# EAGLE schematic 508_outin_imp (EAGLE 8.1.1)
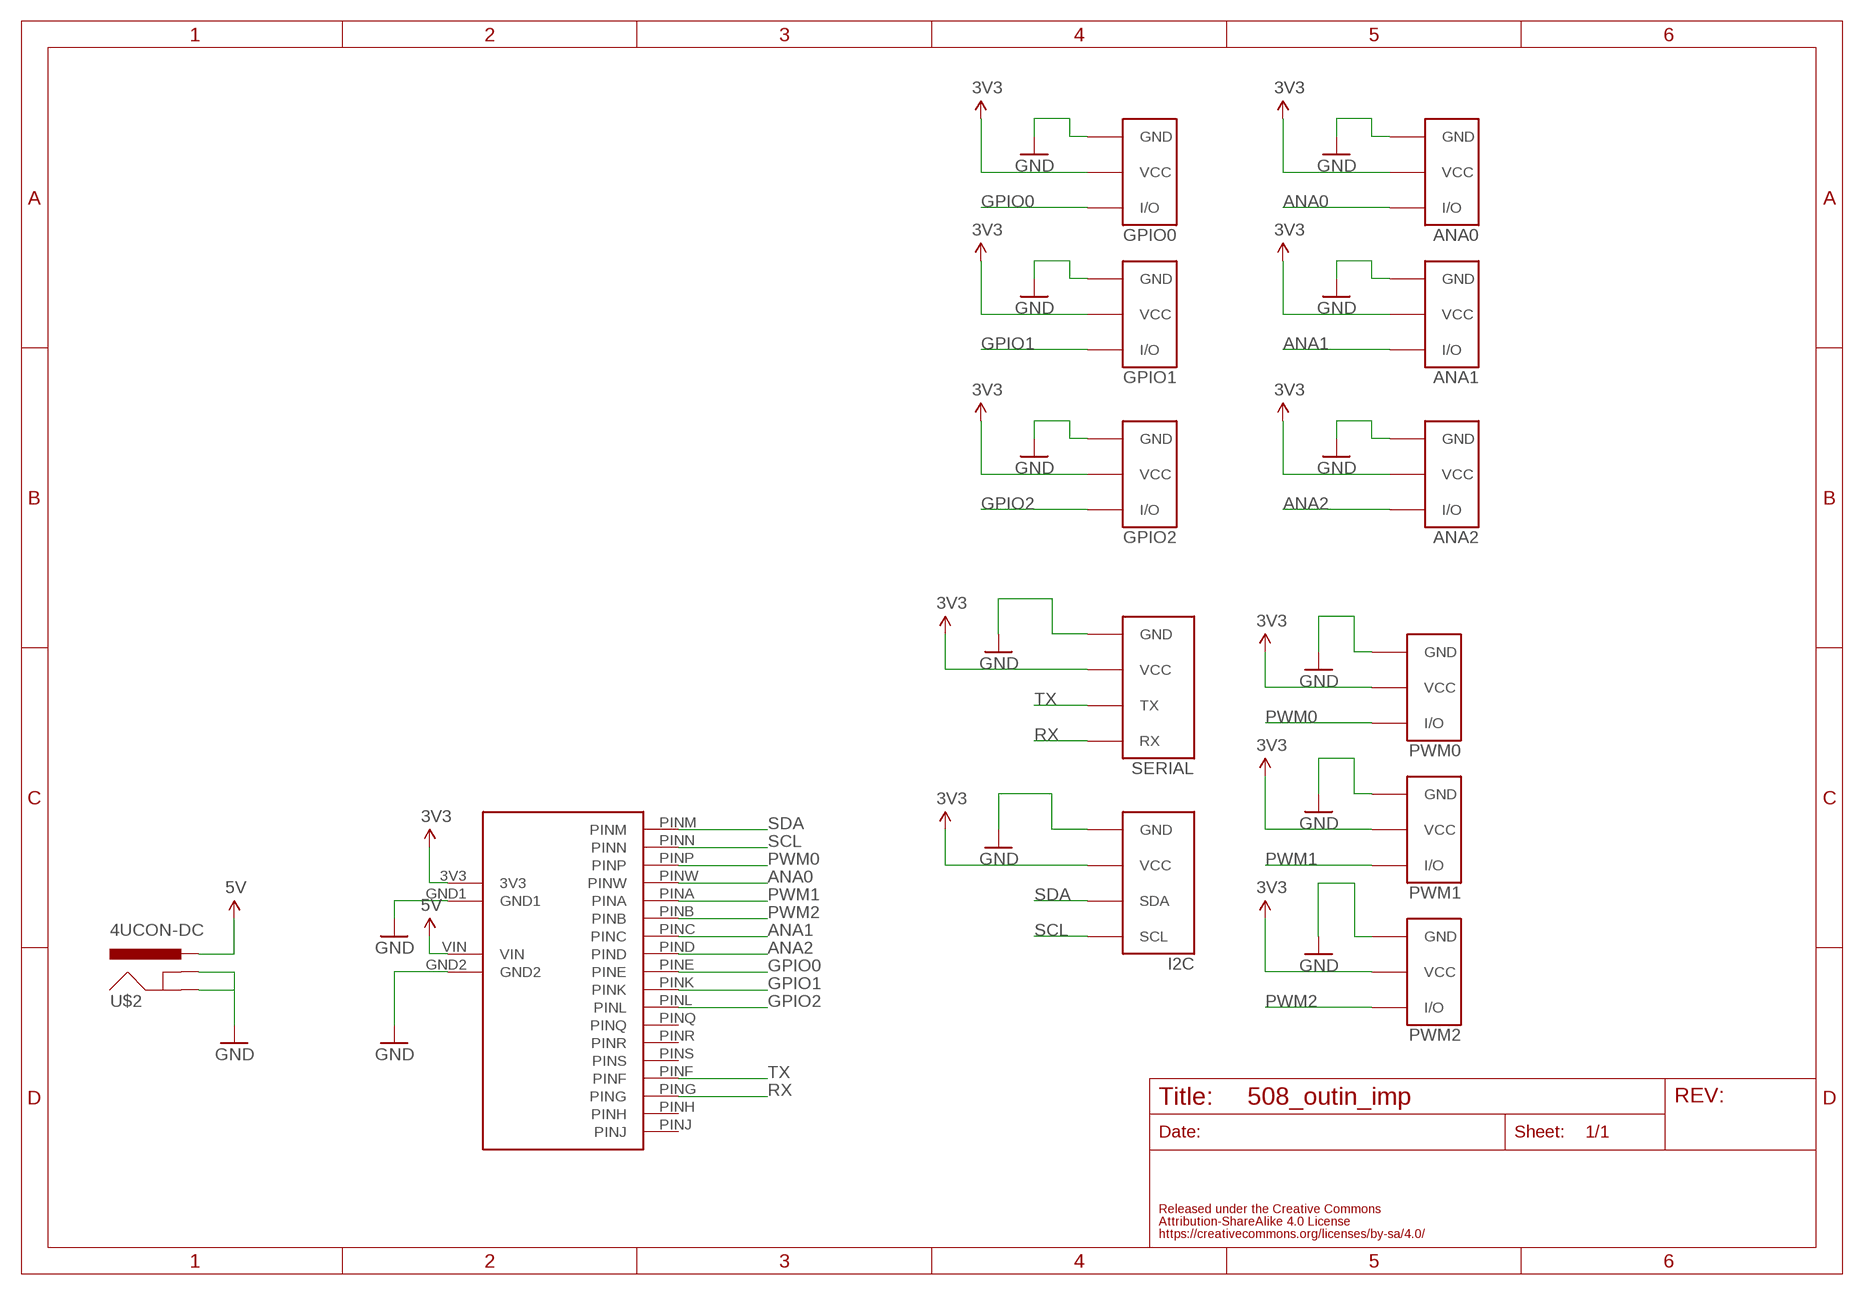
[diagram p0: schematic, sheet 1]

## Parts
ANA0  FABO_BRICK_3PIN-B03B-PASK-1_SILK  [FABO_BRICK_3PIN_B03B-PASK-1_SILK]
ANA1  FABO_BRICK_3PIN-B03B-PASK-1_SILK  [FABO_BRICK_3PIN_B03B-PASK-1_SILK]
ANA2  FABO_BRICK_3PIN-B03B-PASK-1_SILK  [FABO_BRICK_3PIN_B03B-PASK-1_SILK]
GPIO0  FABO_BRICK_3PIN-B03B-PASK-1_SILK  [FABO_BRICK_3PIN_B03B-PASK-1_SILK]
GPIO1  FABO_BRICK_3PIN-B03B-PASK-1_SILK  [FABO_BRICK_3PIN_B03B-PASK-1_SILK]
GPIO2  FABO_BRICK_3PIN-B03B-PASK-1_SILK  [FABO_BRICK_3PIN_B03B-PASK-1_SILK]
I2C  FABO_BRICK_I2C-S04B-PASK-2_LONG  [FABO_BRICK_I2C_S04B-PASK-2_LONG]
PWM0  FABO_BRICK_3PIN-HEADER  [FABO_BRICK_3PIN_HEADER]
PWM1  FABO_BRICK_3PIN-HEADER  [FABO_BRICK_3PIN_HEADER]
PWM2  FABO_BRICK_3PIN-HEADER  [FABO_BRICK_3PIN_HEADER]
SERIAL  FABO_BRICK_SERIAL-S04B-PASK-2_LONG  [FABO_BRICK_SERIAL_S04B-PASK-2_LONG]
U$1  FABO-IMP  [FABO-IMP]
U$2  4UCON-DC  [4UCON-DC]

## Nets
3V3: ANA0.VCC ANA1.VCC ANA2.VCC GPIO0.VCC GPIO1.VCC GPIO2.VCC I2C.VCC PWM0.VCC PWM1.VCC PWM2.VCC SERIAL.VCC U$1.3V3
5V: U$1.VIN U$2.VCC(PWR)
ANA0: ANA0.I/O U$1.PINW
ANA1: ANA1.I/O U$1.PINC
ANA2: ANA2.I/O U$1.PIND
GND: ANA0.GND ANA1.GND ANA2.GND GPIO0.GND GPIO1.GND GPIO2.GND I2C.GND PWM0.GND PWM1.GND PWM2.GND SERIAL.GND U$1.GND1 U$1.GND2 U$2.GND1(GND) U$2.GND2(GNDBREAK)
GPIO0: GPIO0.I/O U$1.PINE
GPIO1: GPIO1.I/O U$1.PINK
GPIO2: GPIO2.I/O U$1.PINL
PWM0: PWM0.I/O U$1.PINP
PWM1: PWM1.I/O U$1.PINA
PWM2: PWM2.I/O U$1.PINB
RX: SERIAL.RX U$1.PING
SCL: I2C.SCL U$1.PINN
SDA: I2C.SDA U$1.PINM
TX: SERIAL.TX U$1.PINF
Unconnected: U$1.PINH U$1.PINJ U$1.PINQ U$1.PINR U$1.PINS

## Library data of the parts
ANA0 ANA1 ANA2 GPIO0 GPIO1 GPIO2 PWM0 PWM1 PWM2 = FaBo-Template:FABO_BRICK_3PIN: FaBo Brick 3pin
I2C = FaBo-Template:FABO_BRICK_I2C: FaBo Brick I2C
SERIAL = FaBo-Template:FABO_BRICK_SERIAL: FaBo Brick Serial
U$1 = FaBo-Template:FABO-IMP
U$2 = FaBo-Supply:4UCON-DC